# EAGLE design SparkFun_IMU_Breakout_ICM-20948 (EAGLE 9.1.3)
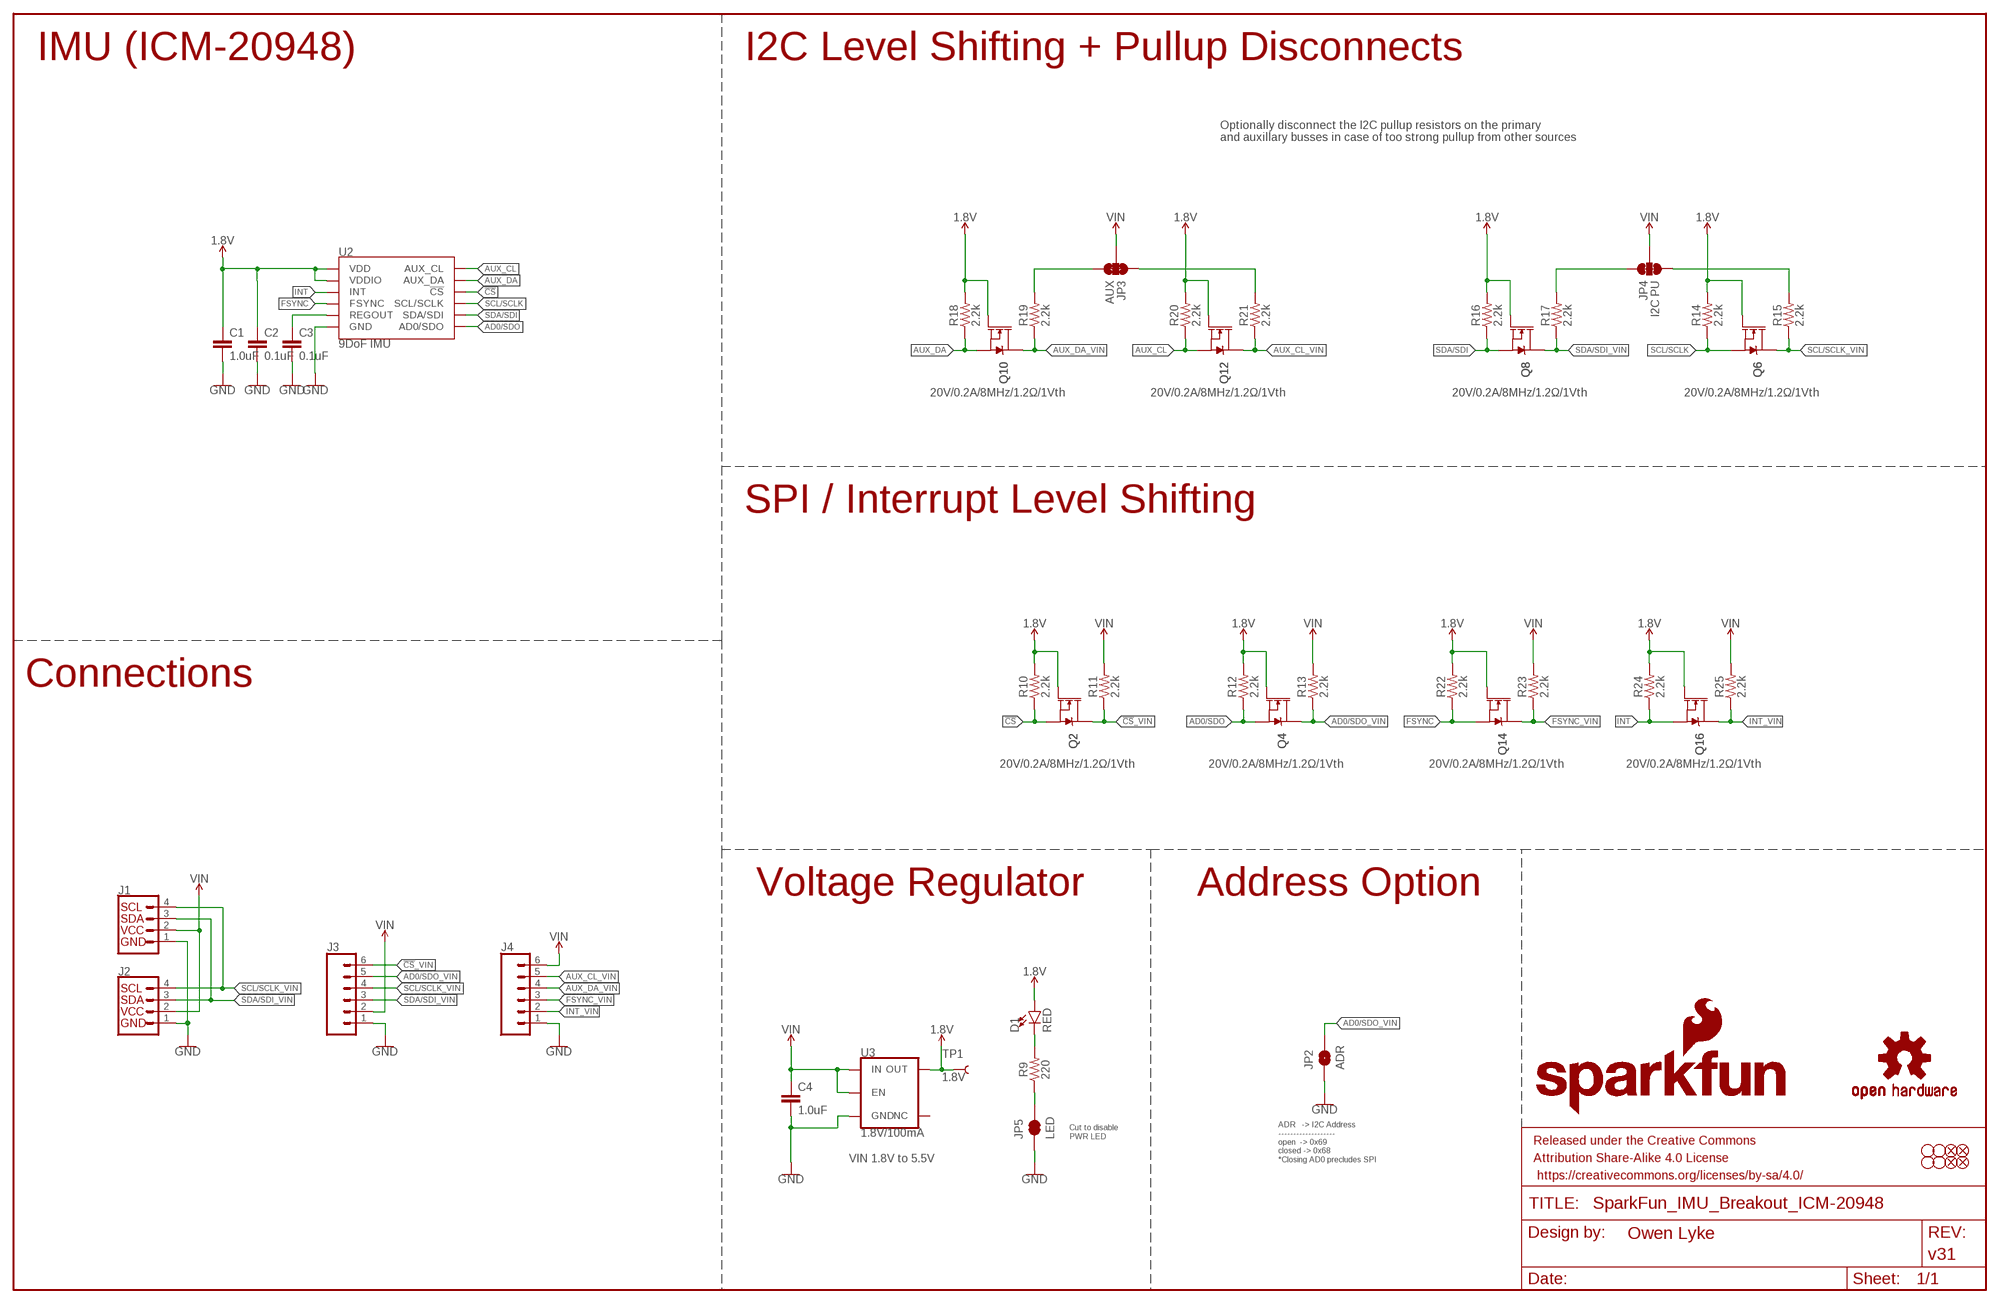
[diagram p0: schematic, sheet 1]

## Parts
C1  1.0uF  1.0UF-0603-16V-10%-X7R  [0603]
C2  0.1uF  0.1UF-0603-25V-5%  [0603]
C3  0.1uF  0.1UF-0603-25V-5%  [0603]
C4  1.0uF  1.0UF-0603-16V-10%-X7R  [0603]
D1  RED  LED-RED0603  [LED-0603]
FD1  FIDUCIAL1X2  [FIDUCIAL-1X2]
FD2  FIDUCIAL1X2  [FIDUCIAL-1X2]
FD3  FIDUCIAL1X2  [FIDUCIAL-1X2]
FD4  FIDUCIAL1X2  [FIDUCIAL-1X2]
FRAME2  FRAME-LEDGER  [CREATIVE_COMMONS]
H1  STAND-OFF  [STAND-OFF]
H2  STAND-OFF  [STAND-OFF]
H3  STAND-OFF  [STAND-OFF]
H4  STAND-OFF  [STAND-OFF]
J1  QWIIC_CONNECTORJS-1MM  [JST04_1MM_RA]
J2  QWIIC_CONNECTORJS-1MM  [JST04_1MM_RA]
J3  CONN_06NO_SILK_NO_POP  [1X06_NO_SILK]
J4  CONN_06NO_SILK_NO_POP  [1X06_NO_SILK]
JP2  ADR  JUMPER-SMT_2_NO_SILK  [SMT-JUMPER_2_NO_SILK]
JP3  AUX  JUMPER-SMT_3_2-NC_TRACE_SILK  [SMT-JUMPER_3_2-NC_TRACE_SILK]
JP4  I2C PU  JUMPER-SMT_3_2-NC_TRACE_SILK  [SMT-JUMPER_3_2-NC_TRACE_SILK]
JP5  LED  JUMPER-SMT_2_NC_TRACE_SILK  [SMT-JUMPER_2_NC_TRACE_SILK]
LOGO1  SFE_LOGO_NAME_FLAME.1_INCH  [SFE_LOGO_NAME_FLAME_.1]
LOGO2  OSHW-LOGOMINI  [OSHW-LOGO-MINI]
Q2  20V/0.2A/8MHz/1.2Ω/1Vth  MOSFET-NCH-RE1C002UN  [SOT-416FL]
Q4  20V/0.2A/8MHz/1.2Ω/1Vth  MOSFET-NCH-RE1C002UN  [SOT-416FL]
Q6  20V/0.2A/8MHz/1.2Ω/1Vth  MOSFET-NCH-RE1C002UN  [SOT-416FL]
Q8  20V/0.2A/8MHz/1.2Ω/1Vth  MOSFET-NCH-RE1C002UN  [SOT-416FL]
Q10  20V/0.2A/8MHz/1.2Ω/1Vth  MOSFET-NCH-RE1C002UN  [SOT-416FL]
Q12  20V/0.2A/8MHz/1.2Ω/1Vth  MOSFET-NCH-RE1C002UN  [SOT-416FL]
Q14  20V/0.2A/8MHz/1.2Ω/1Vth  MOSFET-NCH-RE1C002UN  [SOT-416FL]
Q16  20V/0.2A/8MHz/1.2Ω/1Vth  MOSFET-NCH-RE1C002UN  [SOT-416FL]
R9  220  220OHM-0603-1/10W-1%  [0603]
R10  2.2k  2.2KOHM-0402T-1/16W-1%  [0402-TIGHT]
R11  2.2k  2.2KOHM-0402T-1/16W-1%  [0402-TIGHT]
R12  2.2k  2.2KOHM-0402T-1/16W-1%  [0402-TIGHT]
R13  2.2k  2.2KOHM-0402T-1/16W-1%  [0402-TIGHT]
R14  2.2k  2.2KOHM-0402T-1/16W-1%  [0402-TIGHT]
R15  2.2k  2.2KOHM-0402T-1/16W-1%  [0402-TIGHT]
R16  2.2k  2.2KOHM-0402T-1/16W-1%  [0402-TIGHT]
R17  2.2k  2.2KOHM-0402T-1/16W-1%  [0402-TIGHT]
R18  2.2k  2.2KOHM-0402T-1/16W-1%  [0402-TIGHT]
R19  2.2k  2.2KOHM-0402T-1/16W-1%  [0402-TIGHT]
R20  2.2k  2.2KOHM-0402T-1/16W-1%  [0402-TIGHT]
R21  2.2k  2.2KOHM-0402T-1/16W-1%  [0402-TIGHT]
R22  2.2k  2.2KOHM-0402T-1/16W-1%  [0402-TIGHT]
R23  2.2k  2.2KOHM-0402T-1/16W-1%  [0402-TIGHT]
R24  2.2k  2.2KOHM-0402T-1/16W-1%  [0402-TIGHT]
R25  2.2k  2.2KOHM-0402T-1/16W-1%  [0402-TIGHT]
TP1  1.8V  TEST-POINT3  [PAD.03X.03]
U2  9DoF IMU  ICM-20948  [QFN24-3X3]
U3  1.8V/100mA  V_REG_SP6214-1.8V  [SC70]

## Nets
1.8V: C1.1 C2.1 D1.A Q2.1(G) Q4.1(G) Q6.1(G) Q8.1(G) Q10.1(G) Q12.1(G) Q14.1(G) Q16.1(G) R10.2 R12.2 R14.2 R16.2 R18.2 R20.2 R22.2 R24.2 TP1.P$1 U2.8(VDDIO) U2.13(VDD) U3.5(OUT)
!CS: Q2.2(S) R10.1 U2.22(!CS)
!CS!_VIN: J3.6 Q2.3(D) R11.1
AD0/SDO: Q4.2(S) R12.1 U2.9(AD0/SDO)
AD0/SDO_VIN: J3.5 JP2.2 Q4.3(D) R13.1
AUX_CL: Q12.2(S) R20.1 U2.7(AUX_CL)
AUX_CL_VIN: J4.5 Q12.3(D) R21.1
AUX_DA: Q10.2(S) R18.1 U2.21(AUX_DA)
AUX_DA_VIN: J4.4 Q10.3(D) R19.1
FSYNC: Q14.2(S) R22.1 U2.11(FSYNC)
FSYNC_VIN: J4.3 Q14.3(D) R23.1
GND: C1.2 C2.2 C3.2 C4.2 J1.1 J2.1 J3.1 J4.1 JP2.1 JP5.1 U2.18(GND) U2.20(GND) U3.2(GND)
INT: Q16.2(S) R24.1 U2.12(INT)
INT_VIN: J4.2 Q16.3(D) R25.1
N$1: C3.1 U2.10(REGOUT)
N$2: JP4.3 R15.2
N$3: JP4.1 R17.2
N$4: JP3.1 R21.2
N$5: JP3.3 R19.2
N$9: D1.C R9.2
N$10: JP5.2 R9.1
SCL/SCLK: Q6.2(S) R14.1 U2.23(SCL/SCLK)
SCL/SCLK_VIN: J1.4 J2.4 J3.4 Q6.3(D) R15.1
SDA/SDI: Q8.2(S) R16.1 U2.24(SDA/SDI)
SDA/SDI_VIN: J1.3 J2.3 J3.3 Q8.3(D) R17.1
VIN: C4.1 J1.2 J2.2 J3.2 J4.6 JP3.2 JP4.2 R11.2 R13.2 R23.2 R25.2 U3.1(IN) U3.3(EN)
Unconnected: U3.4(NC)

## Notes on the sheet
- IMU (ICM-20948) | I2C Level Shifting + Pullup Disconnects
- Optionally disconnect the I2C pullup resistors on the primary
  and auxillary busses in case of too strong pullup from other sources
- SPI / Interrupt Level Shifting
- Connections
- Voltage Regulator | Address Option
- Cut to disable
  PWR LED
- VIN 1.8V to 5.5V
- ADR   -> I2C Address
  -------------------
  open  -> 0x69
  closed -> 0x68
  *Closing AD0 precludes SPI

## Library data of the parts
C1 C4 = SparkFun-Capacitors:1.0UF: 1µF ceramic capacitors A capacitor is a passive two-terminal electrical component used to store electrical energy temporarily in an electric field.; PROD_ID: CAP-13930
C2 C3 = SparkFun-Capacitors:0.1UF: 0.1µF ceramic capacitors A capacitor is a passive two-terminal electrical component used to store electrical energy temporarily in an electric field.; PROD_ID: CAP-08604
D1 = SparkFun-LED:LED-RED: Red SMD LED Used in manufacturing of most products at SparkFun Packages: 0603 - SMD 0603 package [Product Link] <http://docs.avagotech.com/docs/AV02-0551EN> 0603 SMART - SMD 0603 SMART package ( more efficient and expensive)[Product Link] <http://www.osram-os.com/Graphics/XPic2/00077099_0.pdf> 1206 - SMD1206 package [Product Link] <https://www.sparkfun.com/datasheets/DevTools/LilyPad/Q150OVS4.pdff> SparkFun Products: Pro Mini 328 -5V <https://www.sparkfun.com/products/821> RedBoard <https://www.sparkfun.com/products/12757> IOIO-OTG <https://www.sparkfun.com/products/13613>; PROD_ID: DIO-00819
FD1-FD4 = SparkFun-Aesthetics:FIDUCIAL: Fiducial Alignment Points Point-of-reference for pick-and-place machines and other optical instruments.
FRAME2 = SparkFun-Aesthetics:FRAME-LEDGER: Schematic Frame - Ledger Standard 11x14 US Ledger frame; DESIGNER: Owen Lyke; REV: v31
H1-H4 = SparkFun-Hardware:STAND-OFF: Stand Off Drill holes for mechanically mounting via screws, standoffs, etc. Note: Use the keepout ring to avoid running the screw head into surrounding components. Variant Overviews STAND-OFF - Mechanical footprint for a #4 phillips button head screw. STAND-OFF-TIGHT - Mechanical footprint for a #4 phillips button head screw, Example SparkFun Products Screw - Phillips Head (1/4", 4-40, 10 pack) <https://www.sparkfun.com/products/10453> (PRT-10453) Screw - Phillips Head (1/2", 4-40, 10 pack) <https://www.sparkfun.com/products/10452> (PRT-10452) Screw - Phillips Head (3/4", 4-40, 10 pack) <https://www.sparkfun.com/products/10451> (PRT-10451) Screw - Phillips Head (1", 4-40, 10 pack) <https://www.sparkfun.com/products/10450> (PRT-10450)
J1 J2 = SparkFun-Connectors:QWIIC_CONNECTOR: SparkFun I2C Standard Qwiic Connector An SMD 1mm pitch JST connector makes it easy and quick (get it? Qwiic?) to connect I2C devices to each other. The Qwiic system <http://www.sparkfun.com/qwiic> enables fast and solderless connection between popular platforms and various sensors and actuators. We carry 200mm <https://www.sparkfun.com/products/14204>, 100mm <https://www.sparkfun.com/products/14205>, 50mm <https://www.sparkfun.com/products/14206>, and breadboard friendly <https://www.sparkfun.com/products/14207> Qwiic cables. We also offer 10 pcs strips <https://www.sparkfun.com/products/14323> the SMD connectors.; PROD_ID: CONN-13694
J3 J4 = SparkFun-Connectors:CONN_06: Multi connection point. Often used as Generic Header-pin footprint for 0.1 inch spaced/style header connections On any of the 0.1 inch spaced packages, you can populate with these: Break Away Headers - Straight <https://www.sparkfun.com/products/116> (PRT-00116) Break Away Male Headers - Right Angle <https://www.sparkfun.com/products/553> (PRT-00553) Female Headers <https://www.sparkfun.com/products/115> (PRT-00115) Break Away Headers - Machine Pin <https://www.sparkfun.com/products/117> (PRT-00117) Break Away Female Headers - Swiss Machine Pin <https://www.sparkfun.com/products/743> (PRT-00743) Arduino Stackable Header - 6 Pin <https://www.sparkfun.com/products/9280> (PRT-09280) For SCREWTERMINALS and SPRING TERMINALS visit here: Screw Terimnals on SparkFun.com <https://www.sparkfun.com/search/results?term=Screw+Terminals> (5mm/3.5mm/2.54mm spacing) This device is also useful as a general connection point to wire up your design to another part of your project. Our various solder wires solder well into these plated through hole pads. Hook-Up Wire - Assortment (Stranded, 22 AWG) <https://www.sparkfun.com/products/11375> (PRT-11375) Hook-Up Wire - Assortment (Solid Core, 22 AWG) <https://www.sparkfun.com/products/11367> (PRT-11367) View the entire wire category on our website here <https://www.sparkfun.com/categories/141>
JP2 = SparkFun-Jumpers:JUMPER-SMT_2_NO: Normally open jumper This jumper has two pads in close proximity to each other. Apply solder to close the connection. Round pads are easier to solder for beginners, but are a lot larger. SparkFun Product that uses the round pads: SparkFun EL Sequencer <https://www.sparkfun.com/products/12781>
JP3 JP4 = SparkFun-Jumpers:JUMPER-SMT_3_2-NC_TRACE: Normally closed trace jumper (2 of 2 connections) This jumper has a trace between all three pads so they are normally closed (NC). Use a razor knife to open the connection(s). For best results follow the IPC guidelines for cutting traces: Cutout at least 0.063 mm (0.005 in). Remove all loose material to clean up the cut area. Seal the cut with an approved epoxy. Reapply solder to reclose the connection(s).
JP5 = SparkFun-Jumpers:JUMPER-SMT_2_NC_TRACE: Normally closed trace jumper This jumper has a trace between two pads so it's normally closed (NC). Use a razor knife to open the connection. For best results follow the IPC guidelines for cutting traces: Cutout at least 0.063 mm (0.005 in). Remove all loose material to clean up the cut area. Seal the cut with an approved epoxy. Reapply solder to reclose the connection.
LOGO1 = SparkFun-Aesthetics:SFE_LOGO_NAME_FLAME: SparkFun Font Logo w/ Flame This is the SparkFun full logo. The logo on the schematic will always be the same size; the package variant is the height of the flame part of the logo. Default layer for the logo on the board is tSilk.
LOGO2 = SparkFun-Aesthetics:OSHW-LOGO: Open-Source Hardware (OSHW) Logo This logo indicates the piece of hardware it is found on incorporates a OSHW license and/or adheres to the definition of open source hardware found here: http://freedomdefined.org/OSHW
Q2 Q4 Q6 Q8 Q10 Q12 Q14 Q16 = SparkFun-DiscreteSemi:MOSFET-NCH: N-channel MOSFETs Voltage controlled devices that allow control of high current outputs. SparkFun Products: SparkFun OpenScale <https://www.sparkfun.com/products/13261> SparkFun Digital Sandbox <https://www.sparkfun.com/products/12651> SparkFun Monster Moto Shield <https://www.sparkfun.com/products/10182> SparkFun MOSFET Power Controller <https://www.sparkfun.com/products/11214>; PROD_ID: TRANS_14399
R9 = SparkFun-Resistors:220OHM: 220Ω resistor A resistor is a passive two-terminal electrical component that implements electrical resistance as a circuit element. Resistors act to reduce current flow, and, at the same time, act to lower voltage levels within circuits. - Wikipedia; PROD_ID: RES-07861
R10-R25 = SparkFun-Resistors:2.2KOHM: 2.2kΩ resistor A resistor is a passive two-terminal electrical component that implements electrical resistance as a circuit element. Resistors act to reduce current flow, and, at the same time, act to lower voltage levels within circuits. - Wikipedia; PROD_ID: RES-14341
TP1 = SparkFun-Connectors:TEST-POINT: SparkFun Test Points Bare copper test points for troubleshooting or In-Circuit-Testing. These are used by our Production team for verifying production board runs using pogo-pins on test beds. SparkFun Products: SparkFun LSM9DS1 Breakout <https://www.sparkfun.com/products/13284> SparkFun PSOC <https://www.sparkfun.com/products/13714> SparkFun Load Cell Amplifier <https://www.sparkfun.com/products/13879>
U2 = SparkFun-Sensors:ICM-20948: ICM-20948 9 Degree of Freedom IMU World’s lowest power 9-axis MotionTracking device that is ideally suited for smartphones, tablets, wearable sensors, and IoT applications. Includes onboard Digital Motion Processor to offload computations from the host processor Datasheet <https://cdn.sparkfun.com/assets/learn_tutorials/5/5/0/MPU9250REV1.0.pdf> SparkFun Products: SparkFun IMU Breakout - ICM-20948 <https://www.sparkfun.com/products/15182>; PROD_ID: IC-14247
U3 = SparkFun-IC-Power:V_REG_SP6214: Voltage Regulator - SP6214 SP6214 Series SC-70-5 Micropower SC-70 100 mA CMOS LDO Regulator Datasheet <https://www.exar.com/content/document.ashx?id=654> SparkFun Products: MP3 Trigger <https://www.sparkfun.com/products/13720> SparkFun Particle Sensor Breakout <https://www.sparkfun.com/products/14045>; PROD_ID: VREG-08428

## Board
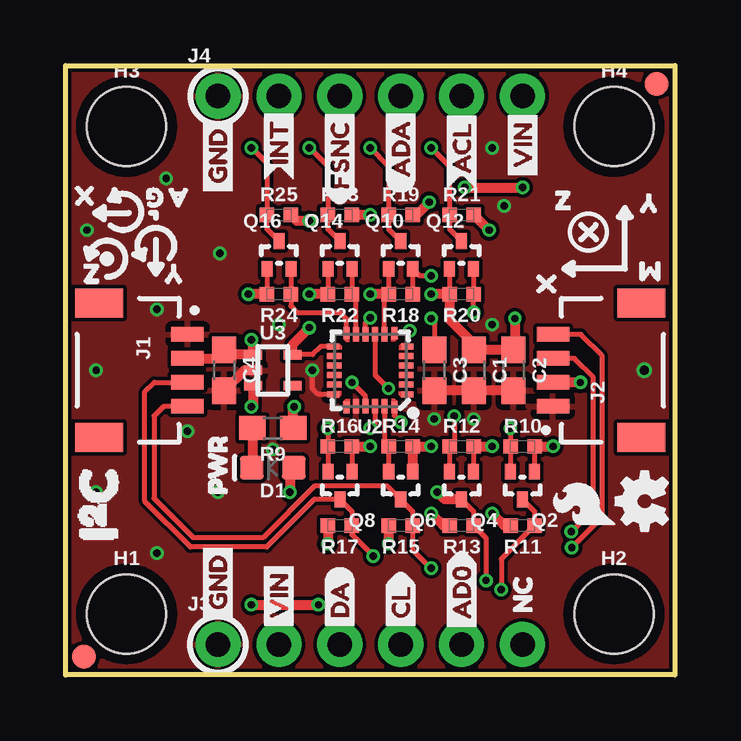
[diagram p1: board, top side]
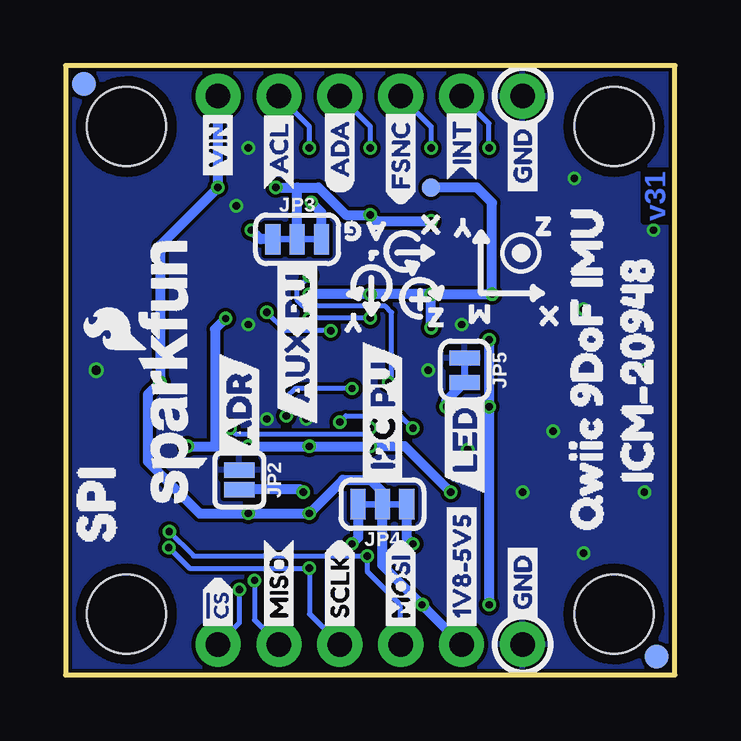
[diagram p2: board, bottom side, seen from below]

Size 25.4 x 25.4 mm. Coordinates in mm from the lower left corner, seen from the top.
Outline: 0,0 0,25.4 25.4,25.4 25.4,0 0,0
Copper layers (1*16): Top 0.035mm / dielectric 1.5mm / Bottom 0.035mm
Design rules "SparkFun-2-layer-FAB-LIMIT": minimum track width 4mil, minimum drill 6mil, track to track 4mil, track to pad 4mil, pad to pad 4mil, via to via 4mil, smd to smd 4mil, copper to edge 4mil, drill to drill 4mil, minimum pad ring 5mil, minimum via ring 5mil, stop-mask expansion 4mil, vias tented up to drill 25mil, thermal gap 10mil

### Footprints (pad centres in the part's own frame; a part is rotated, then mirrored left to right if it is on the bottom)
0603 = smd 1.1 x 1: 1 -0.85,0; 2 0.85,0
LED-0603 = smd 1 x 1: A -0.877,0; C 0.877,0
FIDUCIAL-1X2 = smd 1 x 1: 1 0,0
STAND-OFF = hole 3.302: 0,0
JST04_1MM_RA = smd 0.6 x 1.35: 1 -1.5,0; 2 -0.5,0; 3 0.5,0; 4 1.5,0 | smd 1.2 x 2: NC1 2.8,-3.675; NC2 -2.8,-3.675
1X06_NO_SILK = drill 1.016 pad 1.88: 1 0,0; 2 2.54,0; 3 5.08,0; 4 7.62,0; 5 10.16,0; 6 12.7,0
SMT-JUMPER_2_NO_SILK = smd 0.635 x 1.27: 1 -0.406,0; 2 0.406,0
SMT-JUMPER_3_2-NC_TRACE_SILK = smd 0.635 x 1.27: 1 -1.016,0; 2 0,0; 3 1.016,0
SMT-JUMPER_2_NC_TRACE_SILK = smd 0.635 x 1.27: 1 -0.508,0; 2 0.508,0
SOT-416FL = smd 0.46 x 0.65: 1 -0.5,-1.1; 2 0.5,-1.1; 3 0,0.05
0402-TIGHT = smd 0.6 x 0.6: 1 -0.5,0; 2 0.5,0
PAD.03X.03 = smd 0.762 x 0.762: P$1 0,0
QFN24-3X3 = smd 0.495 x 0.25: 1 -1.552,1; 6 -1.552,-1; 13 1.552,-1; 18 1.552,1 | smd 0.6 x 0.25: 2 -1.5,0.6; 3 -1.5,0.2; 4 -1.5,-0.2; 5 -1.5,-0.6; 14 1.5,-0.6; 15 1.5,-0.2; 16 1.5,0.2; 17 1.5,0.6 | smd 0.25 x 0.495: 7 -1,-1.552; 12 1,-1.552; 19 1,1.552; 24 -1,1.552 | smd 0.25 x 0.6: 8 -0.6,-1.5; 9 -0.2,-1.5; 10 0.2,-1.5; 11 0.6,-1.5; 20 0.6,1.5; 21 0.2,1.5; 22 -0.2,1.5; 23 -0.6,1.5
SC70 = smd 0.4 x 0.75: 1 -0.65,-0.825; 2 0,-0.825; 3 0.65,-0.825; 4 0.65,0.825; 5 -0.65,0.825

### Placement (x,y rotation side)
C1  17.02,12.7 270 top
C2  18.67,12.7 270 top
C3  15.37,12.7 270 top
C4  6.6,12.7 270 top
D1  8.64,8.64 180 top
FD1  24.64,24.64 0 top
FD2  24.64,24.64 0 bottom
FD3  0.76,0.76 0 bottom
FD4  0.76,0.76 0 top
FRAME2  -7.62,-10.41 0 top  (outside the outline)
H1  2.54,2.54 0 top
H2  22.86,2.54 0 top
H3  2.54,22.86 0 top
H4  22.86,22.86 0 top
J1  5.08,12.7 270 top
J2  20.32,12.7 90 top
J3  6.35,1.27 0 top
J4  6.35,24.13 0 top
JP2  18.16,8.13 270 bottom
JP3  15.75,18.16 0 bottom
JP4  12.19,7.11 180 bottom
JP5  8.76,12.7 270 bottom
LOGO1  20.95,12.7 90 bottom
LOGO2  24.13,7.24 90 top
Q2  19.05,7.37 180 top
Q4  16.51,7.37 180 top
Q6  13.97,7.37 180 top
Q8  11.43,7.37 180 top
Q10  13.97,18.03 0 top
Q12  16.51,18.03 0 top
Q14  11.43,18.03 0 top
Q16  8.89,18.03 0 top
R9  8.64,10.29 180 top
R10  19.05,9.53 0 top
R11  19.05,6.22 180 top
R12  16.51,9.53 0 top
R13  16.51,6.22 180 top
R14  13.97,9.53 0 top
R15  13.97,6.22 180 top
R16  11.43,9.53 0 top
R17  11.43,6.22 180 top
R18  13.97,15.88 180 top
R19  13.97,19.18 0 top
R20  16.51,15.88 180 top
R21  16.51,19.18 0 top
R22  11.43,15.88 180 top
R23  11.43,19.18 0 top
R24  8.89,15.88 180 top
R25  8.89,19.18 0 top
TP1  10.16,20.32 0 bottom
U2  12.7,12.7 180 top
U3  8.64,12.7 270 top
U$1  [GND4]  6.35,2.03 90 bottom
U$2  [GND4]  6.35,19.81 90 bottom
U$3  [PWR0]  6.35,6.86 90 top
U$4  [INT3]  8.89,20.57 90 bottom
U$5  [FSNC2]  11.43,19.56 90 bottom
U$6  [ACL1]  16.51,20.19 90 bottom
U$7  [ADA0]  13.97,20.07 90 bottom
U$8  [MISO13]  16.51,1.65 90 bottom
U$9  [MOSI14]  11.43,1.65 90 bottom
U$10  [SCLK15]  13.97,1.65 90 bottom
U$11  [#CS16]  19.05,1.52 90 bottom
U$12  [1V8#5V57]  8.89,1.65 90 bottom
U$13  [VIN5]  8.89,1.65 90 top
U$14  [NC17]  19.05,1.91 90 top
U$15  [CL4]  13.97,1.65 90 top
U$16  [DA2]  11.43,1.65 90 top
U$17  [AD012]  16.51,1.65 90 top
U$18  [ADA0]  13.97,20.07 90 top
U$19  [ACL1]  16.51,20.19 90 top
U$20  [FSNC2]  11.43,19.56 90 top
U$21  [INT3]  8.89,20.57 90 top
U$22  [GND4]  6.35,2.03 90 top
U$23  [ADR2]  18.16,8.64 90 bottom
U$24  [GND4]  6.35,19.81 90 top
U$25  [I2C_PU21]  12.19,7.62 90 bottom
U$26  [SPI19]  24.13,4.19 90 bottom
U$27  [AUX_PU24]  15.75,10.41 90 bottom
U$28  [SFE_LOGO_FLAME_.1]  21.59,7.11 90 top
U$29  [LED23]  8.76,7.49 90 bottom
U$30  [VIN5]  19.05,20.45 90 top
U$31  [ICM#2094820]  1.59,6.92 90 bottom
U$34  [X0]  1.85,19.96 180 top
U$35  [Y1]  5.54,16.71 180 top
U$36  [Z2]  2.11,16.71 180 top
U$37  [G5]  4.78,19.89 180 top
U$38  [A4]  5.79,19.89 180 top
U$39  [M3]  25.52,16.82 180 top
U$40  [X0]  20.04,15.22 90 top
U$41  [Y1]  25.34,19.66 180 top
U$42  [Z2]  19.69,19.79 0 top
U$43  [QWIIC_9DOF_IMU_0]  3.68,4.89 90 bottom
U$44  [VIN5]  19.05,20.45 90 bottom
U$45  [I#C1]  1.37,4.25 90 top
U$49  [M3]  6.99,15.04 180 bottom
U$50  [X0]  4.17,14.96 180 bottom
U$51  [Y1]  7.81,18.64 180 bottom
U$52  [Z2]  4.45,18.69 180 bottom
U$57  [X0]  11.25,18.77 0 bottom
U$58  [Y1]  12.37,14.68 180 bottom
U$59  [Z2]  11,14.91 0 bottom
U$60  [G5]  12.37,18.49 180 bottom
U$61  [A4]  11.35,18.49 180 bottom

### Tracks (layer width: path | path; a pad name or v marks a point on that pad's centre or on a via)
1.8V  (via drill 0.3)
  Top 0.203: R12.2 Q4.1 | R16.2 Q8.1 | R10.2 Q2.1 | Q12.1 R20.2 | Q10.1 R18.2 13.3,15.71 U2.8 | Q14.1 R22.2 | Q16.1 R24.2 | U2.13 10.65,13.7 10.3,13.35 U3.5
  Top 0.406: R24.2 v7.62,15.88 | v15.24,15.88 R20.2 16.01,14.81 17.02,13.8 C1.1 C2.1 18.73,13.55 v18.73,14.86 | R18.2 v12.7,15.88 | R22.2 v10.16,15.88 | R16.2 v12.7,9.53 | v15.24,9.53 R14.2 Q6.1 | R12.2 v17.78,9.53 | R10.2 v20.32,9.53 | v9.35,7.62 9.35,8.47 D1.A | U3.5 9.46,13.78 v10.16,14.48
  Bottom 0.406: v10.16,15.88 v7.62,15.88 7.62,19.68 8.26,20.32 TP1.P$1 | v10.16,15.88 v12.7,15.88 v15.24,15.88 | v20.32,9.53 19.18,9.53 | 19.18,9.53 v17.78,9.53 v15.24,9.53 v12.7,9.53 11.25,9.53 v9.35,7.62 | v10.16,14.48 v10.16,15.88 | v18.73,14.86 19.18,14.41 19.18,9.53
!CS  (via drill 0.3)
  Top 0.203: Q2.2 R10.1 v18.55,10.28 v18.54,10.29 | U2.22 12.9,10.49 v12.7,10.29
  Bottom 0.203: v12.7,10.29 12.95,10.03 18.29,10.03 v18.54,10.29
!CS!_VIN  (via drill 0.3)
  Top 0.203: v18.16,3.56 18.16,4.83 R11.1 19.55,6.82 Q2.3
  Bottom 0.203: v18.16,3.56 18.16,2.16 J3.6
AD0/SDO  (via drill 0.3)
  Top 0.203: Q4.2 R12.1 16.2,9.72 v16.2,10.79 | U2.9 12.9,12.5 v13.46,11.94
  Bottom 0.203: v16.2,10.79 16.2,11.56 15.82,11.94 v13.46,11.94
AD0/SDO_VIN  (via drill 0.3)
  Top 0.203: v17.53,3.94 17.53,5.71 R13.1 17.01,6.82 Q4.3
  Top 0.406: Q4.3 15.8,7.32 v15.49,7.62
  Bottom 0.203: v17.53,3.94 17.53,2.29 J3.5
  Bottom 0.406: v15.49,7.62 15.6,7.72 JP2.2
AUX_CL  (via drill 0.3)
  Top 0.203: Q12.2 R20.1 17.01,15.12 v17.02,15.11 | U2.7 14.25,14.25 v14.35,14.35
  Bottom 0.203: v14.35,14.35 16.26,14.35 v17.02,15.11
AUX_CL_VIN  (via drill 0.3)
  Top 0.203: Q12.3 16.01,18.58 R21.1 16.01,21.2 v15.24,21.97
  Bottom 0.203: v15.24,21.97 15.24,22.86 J4.5
AUX_DA  (via drill 0.3)
  Top 0.203: R18.1 Q10.2 14.77,16.64 v15.24,16.64 | U2.21 12.5,11.63 v11.94,12.19
  Bottom 0.203: v11.94,12.19 11.81,12.32 11.81,15.11 12.06,15.37 15.49,15.37 15.75,15.62 15.75,16.13 v15.24,16.64
AUX_DA_VIN  (via drill 0.3)
  Top 0.203: Q10.3 13.47,18.58 R19.1 13.47,21.2 v12.7,21.97
  Bottom 0.203: v12.7,21.97 12.7,22.86 J4.4
FSYNC
  Top 0.203: Q14.2 R22.1 12.1,15.71 U2.11
FSYNC_VIN  (via drill 0.3)
  Top 0.203: Q14.3 10.93,18.58 R23.1 10.93,21.2 v10.16,21.97
  Bottom 0.203: J4.3 10.16,22.86 v10.16,21.97
GND  (via drill 0.3, 0.38)
  Top 0.203: U2.18 10.53,11.7 10.29,11.94 v10.29,12.7
  Top 0.406: U3.2 7.45,12.7 C4.2 | C2.2 C1.2 C3.2
  other vias: 1.27,12.7 4.19,20.7 0.89,18.54 6.43,17.58 3.81,15.24 1.27,7.62 5.08,10.16 6.35,7.62 3.81,5.08 8.64,9.4 8.89,14.61 17.78,21.97 18.29,19.56 24.13,12.7 15.37,10.67 17.02,10.67 17.78,14.61
  pour Top (isolate 0.152): 0,25.4 25.4,25.4 25.4,0 0,0
  pour Bottom (isolate 0.152): 0,25.4 25.4,25.4 25.4,0 0,0
INT
  Top 0.203: Q16.2 R24.1 9.39,15.38 9.65,15.11 11.43,15.11 11.7,14.84 U2.12
INT_VIN  (via drill 0.3)
  Top 0.203: v7.75,21.97 8.39,21.33 R25.1 8.39,18.58 Q16.3
  Bottom 0.203: v7.75,21.97 7.75,22.99 J4.2
N$1  (via drill 0.3)
  Top 0.203: U2.10 12.5,14.68 v12.7,14.88 | v15.24,14.86 15.37,14.73 C3.1
  Bottom 0.203: v12.7,14.88 15.22,14.88 v15.24,14.86
N$2  (via drill 0.3)
  Top 0.406: v13.46,5.46 v13.47,5.47 R15.2
  Bottom 0.406: JP4.3 13.21,5.71 v13.46,5.46
N$3  (via drill 0.3)
  Top 0.406: R17.2 v10.93,5.47 v10.92,5.46
  Bottom 0.406: v10.92,5.46 11.18,5.71 JP4.1
N$4  (via drill 0.3)
  Top 0.406: v17.65,18.54 R21.2
  Bottom 0.406: v17.65,18.54 17.27,18.16 JP3.1
N$5  (via drill 0.3)
  Top 0.406: v15.16,19.71 14.63,19.18 R19.2
  Bottom 0.406: JP3.3 14.73,19.28 v15.16,19.71
N$9
  Top 0.406: R9.2 7.79,8.66 D1.C
N$10  (via drill 0.3)
  Top 0.406: R9.1 9.49,11.14 v9.53,11.18
  Bottom 0.406: v9.53,11.18 9.53,11.43 JP5.2
SCL/SCLK
  Top 0.203: U2.23 13.3,9.7 R14.1 Q6.2
SCL/SCLK_VIN  (via drill 0.3)
  Top 0.203: J2.4 21.49,14.2 22.35,13.34 22.35,6.56 v21.1,5.31 | J1.4 4.09,11.2 3.68,10.79 3.68,7.37 5.33,5.71 8.22,5.71 10.38,7.87 13.41,7.87 Q6.3 14.47,6.82 R15.1 14.47,5.21 v15.24,4.45
  Bottom 0.203: v21.1,5.31 20.24,4.45 v15.24,4.45 15.24,2.54 J3.4
SDA/SDI  (via drill 0.3)
  Top 0.203: Q8.2 R16.1 v10.93,10.28 v10.92,10.29 | U2.24 13.7,10.81 v13.97,10.54
  Bottom 0.203: v13.97,10.54 13.72,10.79 11.43,10.79 v10.92,10.29
SDA/SDI_VIN  (via drill 0.3)
  Top 0.203: J2.3 21.22,13.2 21.97,12.45 21.97,6.86 v21.08,5.97 | J1.3 3.69,12.2 3.3,11.81 3.3,7.24 5.21,5.33 8.38,5.33 10.36,7.32 Q8.3 11.93,6.82 R17.1 11.93,5.85 v12.83,4.95
  Bottom 0.203: v21.08,5.97 20.07,4.95 v12.83,4.95 12.83,4.32 11.43,2.92 J3.3
VIN  (via drill 0.3)
  Top 0.406: J1.2 6.25,13.2 C4.1 6.8,13.35 U3.1 7.81,13.91 v7.75,13.97 | v10.16,18.92 9.64,18.92 R25.2 | v12.7,19.18 R23.2 | J2.2 v21.45,12.2 v21.46,12.19 | R11.2 18.29,6.22 v17.78,6.73 | R13.2 15.75,6.22 v15.24,6.73 | U3.3 7.81,11.24 v7.75,11.18 | v7.75,2.92 v10.54,2.92 | v16.64,20.32 v19.05,20.32
  Bottom 0.406: v10.16,18.92 12.45,18.92 v12.7,19.18 13.72,19.18 14.86,20.32 15.75,20.32 | J3.2 v10.54,2.92 12.19,4.57 JP4.2 12.19,7.62 12.7,8.13 13.84,8.13 v15.24,6.73 v17.78,6.73 19.81,6.73 21.97,8.89 21.97,11.68 v21.46,12.19 21.46,17.91 v19.05,20.32 J4.6 | v7.75,13.97 v7.75,11.18 v7.75,2.92 | v16.64,20.32 15.75,20.32 | JP3.2 15.75,20.32

### Text on the board
Bottom: v31
tDocu: Owen Lyke